# Altium schematic sheet eSIM.SchDoc
size A; SheetNumber: 2; SheetTotal: 2
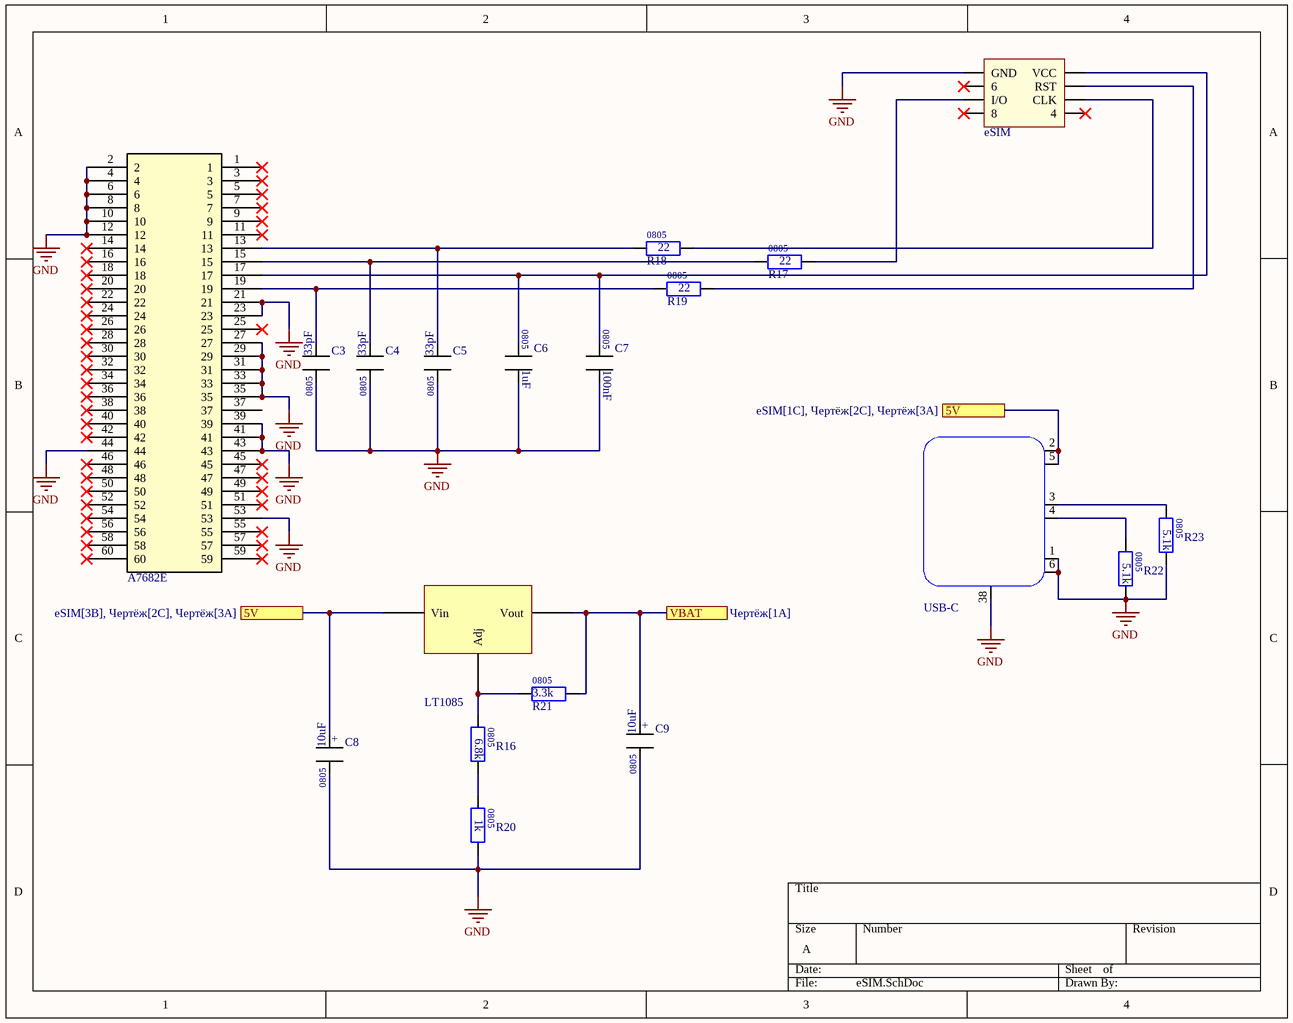
[diagram p0: eSIM.SchDoc]

## Parts
A7682E_J204  A7682E  [A7682]
C3  CC080533pF  [СС0805]  (value not drawn)
C4  CC080533pF  [СС0805]  (value not drawn)
C5  CC080533pF  [СС0805]  (value not drawn)
C6  capacitor  [СС0805]  (value not drawn)
C7  capacitor  [СС0805]  (value not drawn)
C8  capacitor  [CAP JAMOCON]  (value not drawn)
C9  capacitor  [CAP JAMOCON]  (value not drawn)
eSIM1  eSIM  [eSIM]
LT1  LT1085  [LD1058-1]
R16  Resistor  [R0805]  (value not drawn)
R17  Resistor  [R0805]  (value not drawn)
R18  Resistor  [R0805]  (value not drawn)
R19  Resistor  [R0805]  (value not drawn)
R20  Resistor  [R0805]  (value not drawn)
R21  Resistor  [R0805]  (value not drawn)
R22  Resistor  [R0805]  (value not drawn)
R23  Resistor  [R0805]  (value not drawn)
USB-C1  USB-C  [USB C]

## Ports
5V (see eSIM[1C], Чертёж[2C], Чертёж[3A]), 5V (see eSIM[3B], Чертёж[2C], Чертёж[3A]), VBAT (see Чертёж[1A])

## Nets
GND: A7682E_J204.2 A7682E_J204.4 A7682E_J204.6 A7682E_J204.8 A7682E_J204.10 A7682E_J204.12 A7682E_J204.21 A7682E_J204.23 A7682E_J204.27 A7682E_J204.29 A7682E_J204.31 A7682E_J204.33 A7682E_J204.35 A7682E_J204.39 A7682E_J204.41 A7682E_J204.43 A7682E_J204.44 A7682E_J204.53 C3.2 C4.2 C5.2 C6.2 C7.3 C8.3 C9.3 eSIM1.5(GND) R20.1 R22.1 R23.1 USB-C1.1(GND) USB-C1.6(GND) USB-C1.38(SHIELD)
5V: C8.2 LT1.Vin USB-C1.2(VBAS) USB-C1.5(VBAS) ; port 5V
VBAT: C9.2 LT1.Vout R21.1 ; port VBAT
NetA7682E_J204_13: A7682E_J204.13 C5.3 R18.0
NetA7682E_J204_15: A7682E_J204.15 C4.3 R17.0
NetA7682E_J204_17: A7682E_J204.17 C6.3 C7.2 eSIM1.1(VCC)
NetA7682E_J204_19: A7682E_J204.19 C3.3 R19.0
NeteSIM1_2: eSIM1.2(RST) R19.1
NeteSIM1_3: eSIM1.3(CLK) R18.1
NeteSIM1_7: eSIM1.7(I/O) R17.1
NetLT1_Adj: LT1.Adj R16.0 R21.0
NetR16_1: R16.1 R20.0
NetR22_0: R22.0 USB-C1.4(CC2)
NetR23_0: R23.0 USB-C1.3(CC1)

Not connected (* = marked no-connect by the designer): A7682E_J204 1* 3* 5* 7* 9* 11* 14* 16* 18* 20* 22* 24* 25* 26* 28* 30* 32* 34* 36* 37 38* 40* 42* 45* 46* 47* 48* 49* 50* 51* 52* 54* 55* 56* 57* 58* 59* 60*; eSIM1 4* 6* 8*

## Notes on the sheet
- (in symbol CC08051uF) 0805
- (in symbol CC080533pF) 0805
- (in symbol CC0805100nF) 0805
- (in symbol CE080510uF) +; 0805
- (in symbol CR08051kR) 0805
- (in symbol CR08053.3kR) 0805; 3.3k
- (in symbol CR08055.1kR) 0805
- (in symbol CR08056.8kR) 0805
- (in symbol CR080522R) 0805

## Library data of the parts
C3-C5 = CC080533pF: CC0805_33pF; Value: 33pF
C6 = CC08051uF: CC0805_1uF; Value: 1uF
C7 = CC0805100nF: CC0805_100nF; Value: 100nF
C8 C9 = CE080510uF: CE0805_10uF; Value: 10uF
R16 = CR08056.8kR: CR0805_6.8kR; Value: 6.8k
R17-R19 = CR080522R: CR0805_22R; Value: 22
R20 = CR08051kR: CR0805_1kR; Value: 1k
R21 = CR08053.3kR: CR0805_3.3kR
R22 R23 = CR08055.1kR: Value: 5.1k